# EAGLE design Matrix_True (EAGLE 7.1.0)
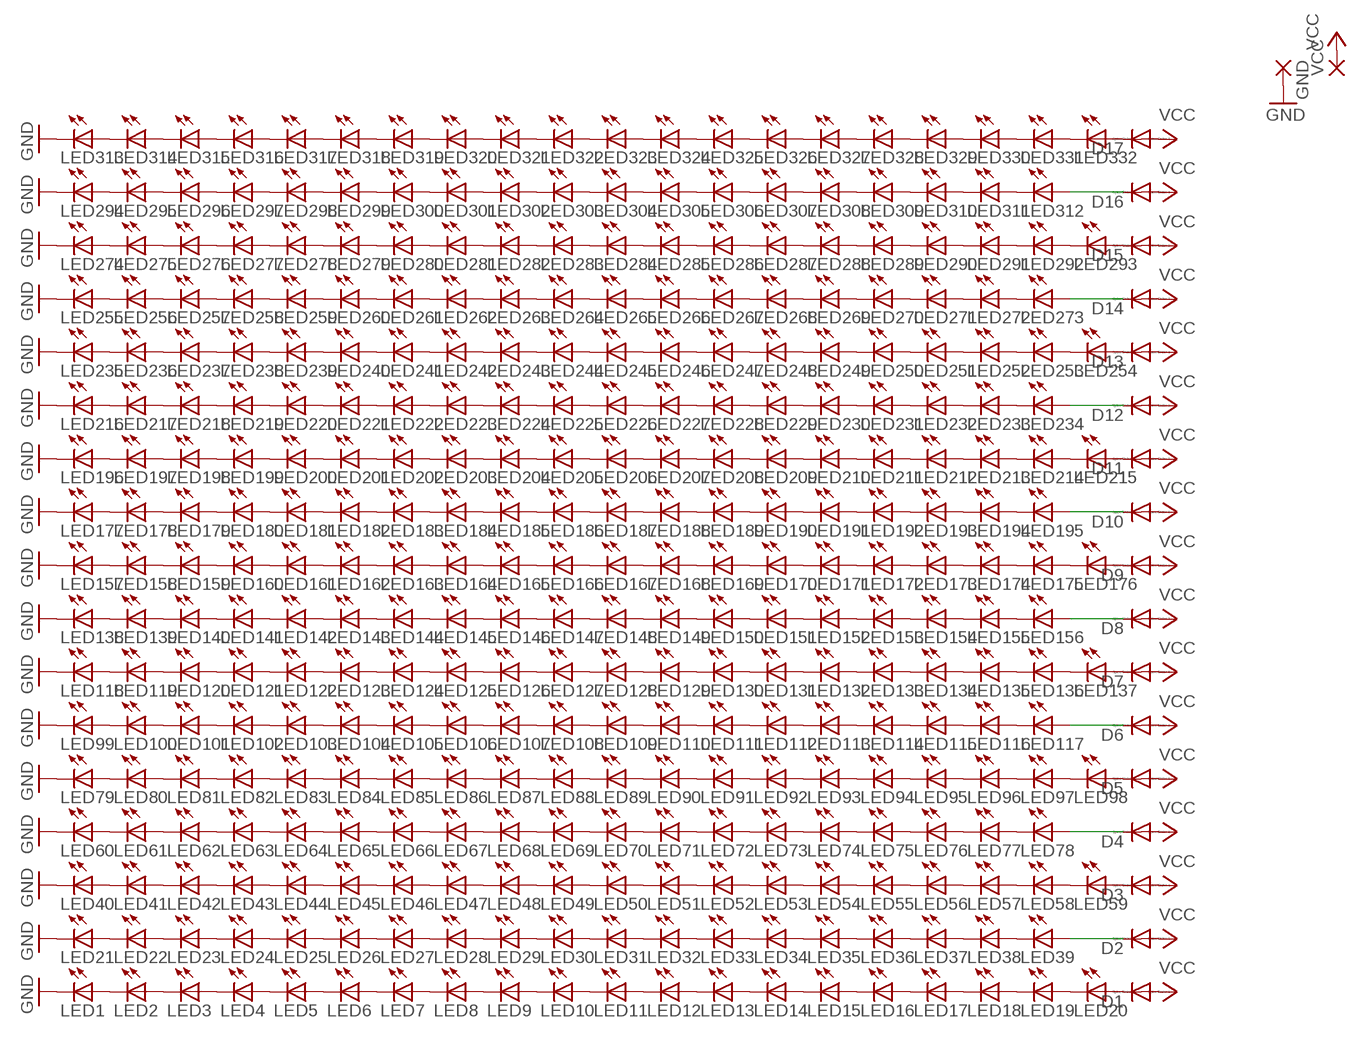
[diagram p0: schematic, sheet 1]

## Parts
D1  DIODE-SOD123  [SOD123]
D2  DIODE-SOD123  [SOD123]
D3  DIODE-SOD123  [SOD123]
D4  DIODE-SOD123  [SOD123]
D5  DIODE-SOD123  [SOD123]
D6  DIODE-SOD123  [SOD123]
D7  DIODE-SOD123  [SOD123]
D8  DIODE-SOD123  [SOD123]
D9  DIODE-SOD123  [SOD123]
D10  DIODE-SOD123  [SOD123]
D11  DIODE-SOD123  [SOD123]
D12  DIODE-SOD123  [SOD123]
D13  DIODE-SOD123  [SOD123]
D14  DIODE-SOD123  [SOD123]
D15  DIODE-SOD123  [SOD123]
D16  DIODE-SOD123  [SOD123]
D17  DIODE-SOD123  [SOD123]
GND  3,17/1,3  [3,17/1,3]
LED1  LED5MM  [LED5MM]
LED2  LED5MM  [LED5MM]
LED3  LED5MM  [LED5MM]
LED4  LED5MM  [LED5MM]
LED5  LED5MM  [LED5MM]
LED6  LED5MM  [LED5MM]
LED7  LED5MM  [LED5MM]
LED8  LED5MM  [LED5MM]
LED9  LED5MM  [LED5MM]
LED10  LED5MM  [LED5MM]
LED11  LED5MM  [LED5MM]
LED12  LED5MM  [LED5MM]
LED13  LED5MM  [LED5MM]
LED14  LED5MM  [LED5MM]
LED15  LED5MM  [LED5MM]
LED16  LED5MM  [LED5MM]
LED17  LED5MM  [LED5MM]
LED18  LED5MM  [LED5MM]
LED19  LED5MM  [LED5MM]
LED20  LED5MM  [LED5MM]
LED21  LED5MM  [LED5MM]
LED22  LED5MM  [LED5MM]
LED23  LED5MM  [LED5MM]
LED24  LED5MM  [LED5MM]
LED25  LED5MM  [LED5MM]
LED26  LED5MM  [LED5MM]
LED27  LED5MM  [LED5MM]
LED28  LED5MM  [LED5MM]
LED29  LED5MM  [LED5MM]
LED30  LED5MM  [LED5MM]
LED31  LED5MM  [LED5MM]
LED32  LED5MM  [LED5MM]
LED33  LED5MM  [LED5MM]
LED34  LED5MM  [LED5MM]
LED35  LED5MM  [LED5MM]
LED36  LED5MM  [LED5MM]
LED37  LED5MM  [LED5MM]
LED38  LED5MM  [LED5MM]
LED39  LED5MM  [LED5MM]
LED40  LED5MM  [LED5MM]
LED41  LED5MM  [LED5MM]
LED42  LED5MM  [LED5MM]
LED43  LED5MM  [LED5MM]
LED44  LED5MM  [LED5MM]
LED45  LED5MM  [LED5MM]
LED46  LED5MM  [LED5MM]
LED47  LED5MM  [LED5MM]
LED48  LED5MM  [LED5MM]
LED49  LED5MM  [LED5MM]
LED50  LED5MM  [LED5MM]
LED51  LED5MM  [LED5MM]
LED52  LED5MM  [LED5MM]
LED53  LED5MM  [LED5MM]
LED54  LED5MM  [LED5MM]
LED55  LED5MM  [LED5MM]
LED56  LED5MM  [LED5MM]
LED57  LED5MM  [LED5MM]
LED58  LED5MM  [LED5MM]
LED59  LED5MM  [LED5MM]
LED60  LED5MM  [LED5MM]
LED61  LED5MM  [LED5MM]
LED62  LED5MM  [LED5MM]
LED63  LED5MM  [LED5MM]
LED64  LED5MM  [LED5MM]
LED65  LED5MM  [LED5MM]
LED66  LED5MM  [LED5MM]
LED67  LED5MM  [LED5MM]
LED68  LED5MM  [LED5MM]
LED69  LED5MM  [LED5MM]
LED70  LED5MM  [LED5MM]
LED71  LED5MM  [LED5MM]
LED72  LED5MM  [LED5MM]
LED73  LED5MM  [LED5MM]
LED74  LED5MM  [LED5MM]
LED75  LED5MM  [LED5MM]
LED76  LED5MM  [LED5MM]
LED77  LED5MM  [LED5MM]
LED78  LED5MM  [LED5MM]
LED79  LED5MM  [LED5MM]
LED80  LED5MM  [LED5MM]
LED81  LED5MM  [LED5MM]
LED82  LED5MM  [LED5MM]
LED83  LED5MM  [LED5MM]
LED84  LED5MM  [LED5MM]
LED85  LED5MM  [LED5MM]
LED86  LED5MM  [LED5MM]
LED87  LED5MM  [LED5MM]
LED88  LED5MM  [LED5MM]
LED89  LED5MM  [LED5MM]
LED90  LED5MM  [LED5MM]
LED91  LED5MM  [LED5MM]
LED92  LED5MM  [LED5MM]
LED93  LED5MM  [LED5MM]
LED94  LED5MM  [LED5MM]
LED95  LED5MM  [LED5MM]
LED96  LED5MM  [LED5MM]
LED97  LED5MM  [LED5MM]
LED98  LED5MM  [LED5MM]
LED99  LED5MM  [LED5MM]
LED100  LED5MM  [LED5MM]
LED101  LED5MM  [LED5MM]
LED102  LED5MM  [LED5MM]
LED103  LED5MM  [LED5MM]
LED104  LED5MM  [LED5MM]
LED105  LED5MM  [LED5MM]
LED106  LED5MM  [LED5MM]
LED107  LED5MM  [LED5MM]
LED108  LED5MM  [LED5MM]
LED109  LED5MM  [LED5MM]
LED110  LED5MM  [LED5MM]
LED111  LED5MM  [LED5MM]
LED112  LED5MM  [LED5MM]
LED113  LED5MM  [LED5MM]
LED114  LED5MM  [LED5MM]
LED115  LED5MM  [LED5MM]
LED116  LED5MM  [LED5MM]
LED117  LED5MM  [LED5MM]
LED118  LED5MM  [LED5MM]
LED119  LED5MM  [LED5MM]
LED120  LED5MM  [LED5MM]
LED121  LED5MM  [LED5MM]
LED122  LED5MM  [LED5MM]
LED123  LED5MM  [LED5MM]
LED124  LED5MM  [LED5MM]
LED125  LED5MM  [LED5MM]
LED126  LED5MM  [LED5MM]
LED127  LED5MM  [LED5MM]
LED128  LED5MM  [LED5MM]
LED129  LED5MM  [LED5MM]
LED130  LED5MM  [LED5MM]
LED131  LED5MM  [LED5MM]
LED132  LED5MM  [LED5MM]
LED133  LED5MM  [LED5MM]
LED134  LED5MM  [LED5MM]
LED135  LED5MM  [LED5MM]
LED136  LED5MM  [LED5MM]
LED137  LED5MM  [LED5MM]
LED138  LED5MM  [LED5MM]
LED139  LED5MM  [LED5MM]
LED140  LED5MM  [LED5MM]
LED141  LED5MM  [LED5MM]
LED142  LED5MM  [LED5MM]
LED143  LED5MM  [LED5MM]
LED144  LED5MM  [LED5MM]
LED145  LED5MM  [LED5MM]
LED146  LED5MM  [LED5MM]
LED147  LED5MM  [LED5MM]
LED148  LED5MM  [LED5MM]
LED149  LED5MM  [LED5MM]
LED150  LED5MM  [LED5MM]
LED151  LED5MM  [LED5MM]
LED152  LED5MM  [LED5MM]
LED153  LED5MM  [LED5MM]
LED154  LED5MM  [LED5MM]
LED155  LED5MM  [LED5MM]
LED156  LED5MM  [LED5MM]
LED157  LED5MM  [LED5MM]
LED158  LED5MM  [LED5MM]
LED159  LED5MM  [LED5MM]
LED160  LED5MM  [LED5MM]
LED161  LED5MM  [LED5MM]
LED162  LED5MM  [LED5MM]
LED163  LED5MM  [LED5MM]
LED164  LED5MM  [LED5MM]
LED165  LED5MM  [LED5MM]
LED166  LED5MM  [LED5MM]
LED167  LED5MM  [LED5MM]
LED168  LED5MM  [LED5MM]
LED169  LED5MM  [LED5MM]
LED170  LED5MM  [LED5MM]
LED171  LED5MM  [LED5MM]
LED172  LED5MM  [LED5MM]
LED173  LED5MM  [LED5MM]
LED174  LED5MM  [LED5MM]
LED175  LED5MM  [LED5MM]
LED176  LED5MM  [LED5MM]
LED177  LED5MM  [LED5MM]
LED178  LED5MM  [LED5MM]
LED179  LED5MM  [LED5MM]
LED180  LED5MM  [LED5MM]
LED181  LED5MM  [LED5MM]
LED182  LED5MM  [LED5MM]
LED183  LED5MM  [LED5MM]
LED184  LED5MM  [LED5MM]
LED185  LED5MM  [LED5MM]
LED186  LED5MM  [LED5MM]
LED187  LED5MM  [LED5MM]
LED188  LED5MM  [LED5MM]
LED189  LED5MM  [LED5MM]
LED190  LED5MM  [LED5MM]
LED191  LED5MM  [LED5MM]
LED192  LED5MM  [LED5MM]
LED193  LED5MM  [LED5MM]
LED194  LED5MM  [LED5MM]
LED195  LED5MM  [LED5MM]
LED196  LED5MM  [LED5MM]
LED197  LED5MM  [LED5MM]
LED198  LED5MM  [LED5MM]
LED199  LED5MM  [LED5MM]
LED200  LED5MM  [LED5MM]
LED201  LED5MM  [LED5MM]
LED202  LED5MM  [LED5MM]
LED203  LED5MM  [LED5MM]
LED204  LED5MM  [LED5MM]
LED205  LED5MM  [LED5MM]
LED206  LED5MM  [LED5MM]
LED207  LED5MM  [LED5MM]
LED208  LED5MM  [LED5MM]
LED209  LED5MM  [LED5MM]
LED210  LED5MM  [LED5MM]
LED211  LED5MM  [LED5MM]
LED212  LED5MM  [LED5MM]
LED213  LED5MM  [LED5MM]
LED214  LED5MM  [LED5MM]
LED215  LED5MM  [LED5MM]
LED216  LED5MM  [LED5MM]
LED217  LED5MM  [LED5MM]
LED218  LED5MM  [LED5MM]
LED219  LED5MM  [LED5MM]
LED220  LED5MM  [LED5MM]
LED221  LED5MM  [LED5MM]
LED222  LED5MM  [LED5MM]
LED223  LED5MM  [LED5MM]
LED224  LED5MM  [LED5MM]
LED225  LED5MM  [LED5MM]
LED226  LED5MM  [LED5MM]
LED227  LED5MM  [LED5MM]
LED228  LED5MM  [LED5MM]
LED229  LED5MM  [LED5MM]
LED230  LED5MM  [LED5MM]
LED231  LED5MM  [LED5MM]
LED232  LED5MM  [LED5MM]
LED233  LED5MM  [LED5MM]
LED234  LED5MM  [LED5MM]
LED235  LED5MM  [LED5MM]
LED236  LED5MM  [LED5MM]
LED237  LED5MM  [LED5MM]
LED238  LED5MM  [LED5MM]
LED239  LED5MM  [LED5MM]
LED240  LED5MM  [LED5MM]
LED241  LED5MM  [LED5MM]
LED242  LED5MM  [LED5MM]
LED243  LED5MM  [LED5MM]
LED244  LED5MM  [LED5MM]
LED245  LED5MM  [LED5MM]
LED246  LED5MM  [LED5MM]
LED247  LED5MM  [LED5MM]
LED248  LED5MM  [LED5MM]
LED249  LED5MM  [LED5MM]
LED250  LED5MM  [LED5MM]
LED251  LED5MM  [LED5MM]
LED252  LED5MM  [LED5MM]
LED253  LED5MM  [LED5MM]
LED254  LED5MM  [LED5MM]
LED255  LED5MM  [LED5MM]
LED256  LED5MM  [LED5MM]
LED257  LED5MM  [LED5MM]
LED258  LED5MM  [LED5MM]
LED259  LED5MM  [LED5MM]
LED260  LED5MM  [LED5MM]
LED261  LED5MM  [LED5MM]
LED262  LED5MM  [LED5MM]
LED263  LED5MM  [LED5MM]
LED264  LED5MM  [LED5MM]
LED265  LED5MM  [LED5MM]
LED266  LED5MM  [LED5MM]
LED267  LED5MM  [LED5MM]
LED268  LED5MM  [LED5MM]
LED269  LED5MM  [LED5MM]
LED270  LED5MM  [LED5MM]
LED271  LED5MM  [LED5MM]
LED272  LED5MM  [LED5MM]
LED273  LED5MM  [LED5MM]
LED274  LED5MM  [LED5MM]
LED275  LED5MM  [LED5MM]
LED276  LED5MM  [LED5MM]
LED277  LED5MM  [LED5MM]
LED278  LED5MM  [LED5MM]
LED279  LED5MM  [LED5MM]
LED280  LED5MM  [LED5MM]
LED281  LED5MM  [LED5MM]
LED282  LED5MM  [LED5MM]
LED283  LED5MM  [LED5MM]
LED284  LED5MM  [LED5MM]
LED285  LED5MM  [LED5MM]
LED286  LED5MM  [LED5MM]
LED287  LED5MM  [LED5MM]
LED288  LED5MM  [LED5MM]
LED289  LED5MM  [LED5MM]
LED290  LED5MM  [LED5MM]
LED291  LED5MM  [LED5MM]
LED292  LED5MM  [LED5MM]
LED293  LED5MM  [LED5MM]
LED294  LED5MM  [LED5MM]
LED295  LED5MM  [LED5MM]
LED296  LED5MM  [LED5MM]
LED297  LED5MM  [LED5MM]
LED298  LED5MM  [LED5MM]
LED299  LED5MM  [LED5MM]
LED300  LED5MM  [LED5MM]
LED301  LED5MM  [LED5MM]
LED302  LED5MM  [LED5MM]
LED303  LED5MM  [LED5MM]
LED304  LED5MM  [LED5MM]
LED305  LED5MM  [LED5MM]
LED306  LED5MM  [LED5MM]
LED307  LED5MM  [LED5MM]
LED308  LED5MM  [LED5MM]
LED309  LED5MM  [LED5MM]
LED310  LED5MM  [LED5MM]
LED311  LED5MM  [LED5MM]
LED312  LED5MM  [LED5MM]
LED313  LED5MM  [LED5MM]
LED314  LED5MM  [LED5MM]
LED315  LED5MM  [LED5MM]
LED316  LED5MM  [LED5MM]
LED317  LED5MM  [LED5MM]
LED318  LED5MM  [LED5MM]
LED319  LED5MM  [LED5MM]
LED320  LED5MM  [LED5MM]
LED321  LED5MM  [LED5MM]
LED322  LED5MM  [LED5MM]
LED323  LED5MM  [LED5MM]
LED324  LED5MM  [LED5MM]
LED325  LED5MM  [LED5MM]
LED326  LED5MM  [LED5MM]
LED327  LED5MM  [LED5MM]
LED328  LED5MM  [LED5MM]
LED329  LED5MM  [LED5MM]
LED330  LED5MM  [LED5MM]
LED331  LED5MM  [LED5MM]
LED332  LED5MM  [LED5MM]
VCC  3,17/1,3  [3,17/1,3]

## Nets
GND: GND.1(P) LED1.K(C) LED21.K(C) LED40.K(C) LED60.K(C) LED79.K(C) LED99.K(C) LED118.K(C) LED138.K(C) LED157.K(C) LED177.K(C) LED196.K(C) LED216.K(C) LED235.K(C) LED255.K(C) LED274.K(C) LED294.K(C) LED313.K(C)
N$1: LED1.A LED2.K(C)
N$2: LED2.A LED3.K(C)
N$3: LED3.A LED4.K(C)
N$4: LED4.A LED5.K(C)
N$5: LED5.A LED6.K(C)
N$6: LED6.A LED7.K(C)
N$7: LED7.A LED8.K(C)
N$8: LED8.A LED9.K(C)
N$9: LED9.A LED10.K(C)
N$10: LED10.A LED11.K(C)
N$11: LED11.A LED12.K(C)
N$12: LED12.A LED13.K(C)
N$13: LED13.A LED14.K(C)
N$14: LED14.A LED15.K(C)
N$15: LED15.A LED16.K(C)
N$16: LED16.A LED17.K(C)
N$17: LED17.A LED18.K(C)
N$18: LED18.A LED19.K(C)
N$19: LED19.A LED20.K(C)
N$20: D1.C LED20.A
N$21: LED21.A LED22.K(C)
N$22: LED22.A LED23.K(C)
N$23: LED23.A LED24.K(C)
N$24: LED24.A LED25.K(C)
N$25: LED25.A LED26.K(C)
N$26: LED26.A LED27.K(C)
N$27: LED27.A LED28.K(C)
N$28: LED28.A LED29.K(C)
N$29: LED29.A LED30.K(C)
N$30: LED30.A LED31.K(C)
N$31: LED31.A LED32.K(C)
N$32: LED32.A LED33.K(C)
N$33: LED33.A LED34.K(C)
N$34: LED34.A LED35.K(C)
N$35: LED35.A LED36.K(C)
N$36: LED36.A LED37.K(C)
N$37: LED37.A LED38.K(C)
N$38: LED38.A LED39.K(C)
N$39: D2.C LED39.A
N$40: LED40.A LED41.K(C)
N$41: LED41.A LED42.K(C)
N$42: LED42.A LED43.K(C)
N$43: LED43.A LED44.K(C)
N$44: LED44.A LED45.K(C)
N$45: LED45.A LED46.K(C)
N$46: LED46.A LED47.K(C)
N$47: LED47.A LED48.K(C)
N$48: LED48.A LED49.K(C)
N$49: LED49.A LED50.K(C)
N$50: LED50.A LED51.K(C)
N$51: LED51.A LED52.K(C)
N$52: LED52.A LED53.K(C)
N$53: LED53.A LED54.K(C)
N$54: LED54.A LED55.K(C)
N$55: LED55.A LED56.K(C)
N$56: LED56.A LED57.K(C)
N$57: LED57.A LED58.K(C)
N$58: LED58.A LED59.K(C)
N$59: D3.C LED59.A
N$60: LED60.A LED61.K(C)
N$61: LED61.A LED62.K(C)
N$62: LED62.A LED63.K(C)
N$63: LED63.A LED64.K(C)
N$64: LED64.A LED65.K(C)
N$65: LED65.A LED66.K(C)
N$66: LED66.A LED67.K(C)
N$67: LED67.A LED68.K(C)
N$68: LED68.A LED69.K(C)
N$69: LED69.A LED70.K(C)
N$70: LED70.A LED71.K(C)
N$71: LED71.A LED72.K(C)
N$72: LED72.A LED73.K(C)
N$73: LED73.A LED74.K(C)
N$74: LED74.A LED75.K(C)
N$75: LED75.A LED76.K(C)
N$76: LED76.A LED77.K(C)
N$77: LED77.A LED78.K(C)
N$78: D4.C LED78.A
N$79: LED79.A LED80.K(C)
N$80: LED80.A LED81.K(C)
N$81: LED81.A LED82.K(C)
N$82: LED82.A LED83.K(C)
N$83: LED83.A LED84.K(C)
N$84: LED84.A LED85.K(C)
N$85: LED85.A LED86.K(C)
N$86: LED86.A LED87.K(C)
N$87: LED87.A LED88.K(C)
N$88: LED88.A LED89.K(C)
N$89: LED89.A LED90.K(C)
N$90: LED90.A LED91.K(C)
N$91: LED91.A LED92.K(C)
N$92: LED92.A LED93.K(C)
N$93: LED93.A LED94.K(C)
N$94: LED94.A LED95.K(C)
N$95: LED95.A LED96.K(C)
N$96: LED96.A LED97.K(C)
N$97: LED97.A LED98.K(C)
N$98: D5.C LED98.A
N$99: LED99.A LED100.K(C)
N$100: LED100.A LED101.K(C)
N$101: LED101.A LED102.K(C)
N$102: LED102.A LED103.K(C)
N$103: LED103.A LED104.K(C)
N$104: LED104.A LED105.K(C)
N$105: LED105.A LED106.K(C)
N$106: LED106.A LED107.K(C)
N$107: LED107.A LED108.K(C)
N$108: LED108.A LED109.K(C)
N$109: LED109.A LED110.K(C)
N$110: LED110.A LED111.K(C)
N$111: LED111.A LED112.K(C)
N$112: LED112.A LED113.K(C)
N$113: LED113.A LED114.K(C)
N$114: LED114.A LED115.K(C)
N$115: LED115.A LED116.K(C)
N$116: LED116.A LED117.K(C)
N$117: D6.C LED117.A
N$118: LED118.A LED119.K(C)
N$119: LED119.A LED120.K(C)
N$120: LED120.A LED121.K(C)
N$121: LED121.A LED122.K(C)
N$122: LED122.A LED123.K(C)
N$123: LED123.A LED124.K(C)
N$124: LED124.A LED125.K(C)
N$125: LED125.A LED126.K(C)
N$126: LED126.A LED127.K(C)
N$127: LED127.A LED128.K(C)
N$128: LED128.A LED129.K(C)
N$129: LED129.A LED130.K(C)
N$130: LED130.A LED131.K(C)
N$131: LED131.A LED132.K(C)
N$132: LED132.A LED133.K(C)
N$133: LED133.A LED134.K(C)
N$134: LED134.A LED135.K(C)
N$135: LED135.A LED136.K(C)
N$136: LED136.A LED137.K(C)
N$137: D7.C LED137.A
N$138: LED138.A LED139.K(C)
N$139: LED139.A LED140.K(C)
N$140: LED140.A LED141.K(C)
N$141: LED141.A LED142.K(C)
N$142: LED142.A LED143.K(C)
N$143: LED143.A LED144.K(C)
N$144: LED144.A LED145.K(C)
N$145: LED145.A LED146.K(C)
N$146: LED146.A LED147.K(C)
N$147: LED147.A LED148.K(C)
N$148: LED148.A LED149.K(C)
N$149: LED149.A LED150.K(C)
N$150: LED150.A LED151.K(C)
N$151: LED151.A LED152.K(C)
N$152: LED152.A LED153.K(C)
N$153: LED153.A LED154.K(C)
N$154: LED154.A LED155.K(C)
N$155: LED155.A LED156.K(C)
N$156: D8.C LED156.A
N$157: LED157.A LED158.K(C)
N$158: LED158.A LED159.K(C)
N$159: LED159.A LED160.K(C)
N$160: LED160.A LED161.K(C)
N$161: LED161.A LED162.K(C)
N$162: LED162.A LED163.K(C)
N$163: LED163.A LED164.K(C)
N$164: LED164.A LED165.K(C)
N$165: LED165.A LED166.K(C)
N$166: LED166.A LED167.K(C)
N$167: LED167.A LED168.K(C)
N$168: LED168.A LED169.K(C)
N$169: LED169.A LED170.K(C)
N$170: LED170.A LED171.K(C)
N$171: LED171.A LED172.K(C)
N$172: LED172.A LED173.K(C)
N$173: LED173.A LED174.K(C)
N$174: LED174.A LED175.K(C)
N$175: LED175.A LED176.K(C)
N$176: D9.C LED176.A
N$177: LED177.A LED178.K(C)
N$178: LED178.A LED179.K(C)
N$179: LED179.A LED180.K(C)
N$180: LED180.A LED181.K(C)
N$181: LED181.A LED182.K(C)
N$182: LED182.A LED183.K(C)
N$183: LED183.A LED184.K(C)
N$184: LED184.A LED185.K(C)
N$185: LED185.A LED186.K(C)
N$186: LED186.A LED187.K(C)
N$187: LED187.A LED188.K(C)
N$188: LED188.A LED189.K(C)
N$189: LED189.A LED190.K(C)
N$190: LED190.A LED191.K(C)
N$191: LED191.A LED192.K(C)
N$192: LED192.A LED193.K(C)
N$193: LED193.A LED194.K(C)
N$194: LED194.A LED195.K(C)
N$195: D10.C LED195.A
N$196: LED196.A LED197.K(C)
N$197: LED197.A LED198.K(C)
N$198: LED198.A LED199.K(C)
N$199: LED199.A LED200.K(C)
N$200: LED200.A LED201.K(C)
N$201: LED201.A LED202.K(C)
N$202: LED202.A LED203.K(C)
N$203: LED203.A LED204.K(C)
N$204: LED204.A LED205.K(C)
N$205: LED205.A LED206.K(C)
N$206: LED206.A LED207.K(C)
N$207: LED207.A LED208.K(C)
N$208: LED208.A LED209.K(C)
N$209: LED209.A LED210.K(C)
N$210: LED210.A LED211.K(C)
N$211: LED211.A LED212.K(C)
N$212: LED212.A LED213.K(C)
N$213: LED213.A LED214.K(C)
N$214: LED214.A LED215.K(C)
N$215: D11.C LED215.A
N$216: LED216.A LED217.K(C)
N$217: LED217.A LED218.K(C)
N$218: LED218.A LED219.K(C)
N$219: LED219.A LED220.K(C)
N$220: LED220.A LED221.K(C)
N$221: LED221.A LED222.K(C)
N$222: LED222.A LED223.K(C)
N$223: LED223.A LED224.K(C)
N$224: LED224.A LED225.K(C)
N$225: LED225.A LED226.K(C)
N$226: LED226.A LED227.K(C)
N$227: LED227.A LED228.K(C)
N$228: LED228.A LED229.K(C)
N$229: LED229.A LED230.K(C)
N$230: LED230.A LED231.K(C)
N$231: LED231.A LED232.K(C)
N$232: LED232.A LED233.K(C)
N$233: LED233.A LED234.K(C)
N$234: D12.C LED234.A
N$235: LED235.A LED236.K(C)
N$236: LED236.A LED237.K(C)
N$237: LED237.A LED238.K(C)
N$238: LED238.A LED239.K(C)
N$239: LED239.A LED240.K(C)
N$240: LED240.A LED241.K(C)
N$241: LED241.A LED242.K(C)
N$242: LED242.A LED243.K(C)
N$243: LED243.A LED244.K(C)
N$244: LED244.A LED245.K(C)
N$245: LED245.A LED246.K(C)
N$246: LED246.A LED247.K(C)
N$247: LED247.A LED248.K(C)
N$248: LED248.A LED249.K(C)
N$249: LED249.A LED250.K(C)
N$250: LED250.A LED251.K(C)
N$251: LED251.A LED252.K(C)
N$252: LED252.A LED253.K(C)
N$253: LED253.A LED254.K(C)
N$254: D13.C LED254.A
N$255: LED255.A LED256.K(C)
N$256: LED256.A LED257.K(C)
N$257: LED257.A LED258.K(C)
N$258: LED258.A LED259.K(C)
N$259: LED259.A LED260.K(C)
N$260: LED260.A LED261.K(C)
N$261: LED261.A LED262.K(C)
N$262: LED262.A LED263.K(C)
N$263: LED263.A LED264.K(C)
N$264: LED264.A LED265.K(C)
N$265: LED265.A LED266.K(C)
N$266: LED266.A LED267.K(C)
N$267: LED267.A LED268.K(C)
N$268: LED268.A LED269.K(C)
N$269: LED269.A LED270.K(C)
N$270: LED270.A LED271.K(C)
N$271: LED271.A LED272.K(C)
N$272: LED272.A LED273.K(C)
N$273: D14.C LED273.A
N$274: LED274.A LED275.K(C)
N$275: LED275.A LED276.K(C)
N$276: LED276.A LED277.K(C)
N$277: LED277.A LED278.K(C)
N$278: LED278.A LED279.K(C)
N$279: LED279.A LED280.K(C)
N$280: LED280.A LED281.K(C)
N$281: LED281.A LED282.K(C)
N$282: LED282.A LED283.K(C)
N$283: LED283.A LED284.K(C)
N$284: LED284.A LED285.K(C)
N$285: LED285.A LED286.K(C)
N$286: LED286.A LED287.K(C)
N$287: LED287.A LED288.K(C)
N$288: LED288.A LED289.K(C)
N$289: LED289.A LED290.K(C)
N$290: LED290.A LED291.K(C)
N$291: LED291.A LED292.K(C)
N$292: LED292.A LED293.K(C)
N$293: D15.C LED293.A
N$294: LED294.A LED295.K(C)
N$295: LED295.A LED296.K(C)
N$296: LED296.A LED297.K(C)
N$297: LED297.A LED298.K(C)
N$298: LED298.A LED299.K(C)
N$299: LED299.A LED300.K(C)
N$300: LED300.A LED301.K(C)
N$301: LED301.A LED302.K(C)
N$302: LED302.A LED303.K(C)
N$303: LED303.A LED304.K(C)
N$304: LED304.A LED305.K(C)
N$305: LED305.A LED306.K(C)
N$306: LED306.A LED307.K(C)
N$307: LED307.A LED308.K(C)
N$308: LED308.A LED309.K(C)
N$309: LED309.A LED310.K(C)
N$310: LED310.A LED311.K(C)
N$311: LED311.A LED312.K(C)
N$312: D16.C LED312.A
N$313: LED313.A LED314.K(C)
N$314: LED314.A LED315.K(C)
N$315: LED315.A LED316.K(C)
N$316: LED316.A LED317.K(C)
N$317: LED317.A LED318.K(C)
N$318: LED318.A LED319.K(C)
N$319: LED319.A LED320.K(C)
N$320: LED320.A LED321.K(C)
N$321: LED321.A LED322.K(C)
N$322: LED322.A LED323.K(C)
N$323: LED323.A LED324.K(C)
N$324: LED324.A LED325.K(C)
N$325: LED325.A LED326.K(C)
N$326: LED326.A LED327.K(C)
N$327: LED327.A LED328.K(C)
N$328: LED328.A LED329.K(C)
N$329: LED329.A LED330.K(C)
N$330: LED330.A LED331.K(C)
N$331: LED331.A LED332.K(C)
N$332: D17.C LED332.A
VCC: D1.A D2.A D3.A D4.A D5.A D6.A D7.A D8.A D9.A D10.A D11.A D12.A D13.A D14.A D15.A D16.A D17.A VCC.1(P)

## Library data of the parts
D1-D17 = diode:DIODE-: DIODE
GND VCC = wirepad:3,17/1,3: THROUGH-HOLE PAD
LED1-LED332 = led:LED: LED OSRAM: - CHIPLED LG R971, LG N971, LY N971, LG Q971, LY Q971, LO R971, LY R971 LH N974, LH R974 LS Q976, LO Q976, LY Q976 LO Q996 - Hyper CHIPLED LW Q18S LB Q993, LB Q99A, LB R99A - SideLED LS A670, LO A670, LY A670, LG A670, LP A670 LB A673, LV A673, LT A673, LW A673 LH A674 LY A675 LS A676, LA A676, LO A676, LY A676, LW A676 LS A679, LY A679, LG A679 - Hyper Micro SIDELED® LS Y876, LA Y876, LO Y876, LY Y876 LT Y87S - SmartLED LW L88C, LW L88S LB L89C, LB L89S, LG L890 LS L89K, LO L89K, LY L89K LS L896, LA L896, LO L896, LY L896 - TOPLED LS T670, LO T670, LY T670, LG T670, LP T670 LSG T670, LSP T670, LSY T670, LOP T670, LYG T670 LG T671, LOG T671, LSG T671 LB T673, LV T673, LT T673, LW T673 LH T674 LS T676, LA T676, LO T676, LY T676, LB T676, LH T676, LSB T676, LW T676 LB T67C, LV T67C, LT T67C, LS T67K, LO T67K, LY T67K, LW E67C LS E67B, LA E67B, LO E67B, LY E67B, LB E67C, LV E67C, LT E67C LW T67C LS T679, LY T679, LG T679 LS T770, LO T770, LY T770, LG T770, LP T770 LB T773, LV T773, LT T773, LW T773 LH T774 LS E675, LA E675, LY E675, LS T675 LS T776, LA T776, LO T776, LY T776, LB T776 LHGB T686 LT T68C, LB T68C - Hyper Mini TOPLED® LB M676 - Mini TOPLED Santana® LG M470 LS M47K, LO M47K, LY M47K Source: http://www.osram.convergy.de LUXEON: - LUMILED® LXK2-PW12-R00, LXK2-PW12-S00, LXK2-PW14-U00, LXK2-PW14-V00 LXK2-PM12-R00, LXK2-PM12-S00, LXK2-PM14-U00 LXK2-PE12-Q00, LXK2-PE12-R00, LXK2-PE12-S00, LXK2-PE14-T00, LXK2-PE14-U00 LXK2-PB12-K00, LXK2-PB12-L00, LXK2-PB12-M00, LXK2-PB14-N00, LXK2-PB14-P00, LXK2-PB14-Q00 LXK2-PR12-L00, LXK2-PR12-M00, LXK2-PR14-Q00, LXK2-PR14-R00 LXK2-PD12-Q00, LXK2-PD12-R00, LXK2-PD12-S00 LXK2-PH12-R00, LXK2-PH12-S00 LXK2-PL12-P00, LXK2-PL12-Q00, LXK2-PL12-R00 Source: www.luxeon.com KINGBRIGHT: KA-3528ASYC Source: www.kingbright.com

## Board
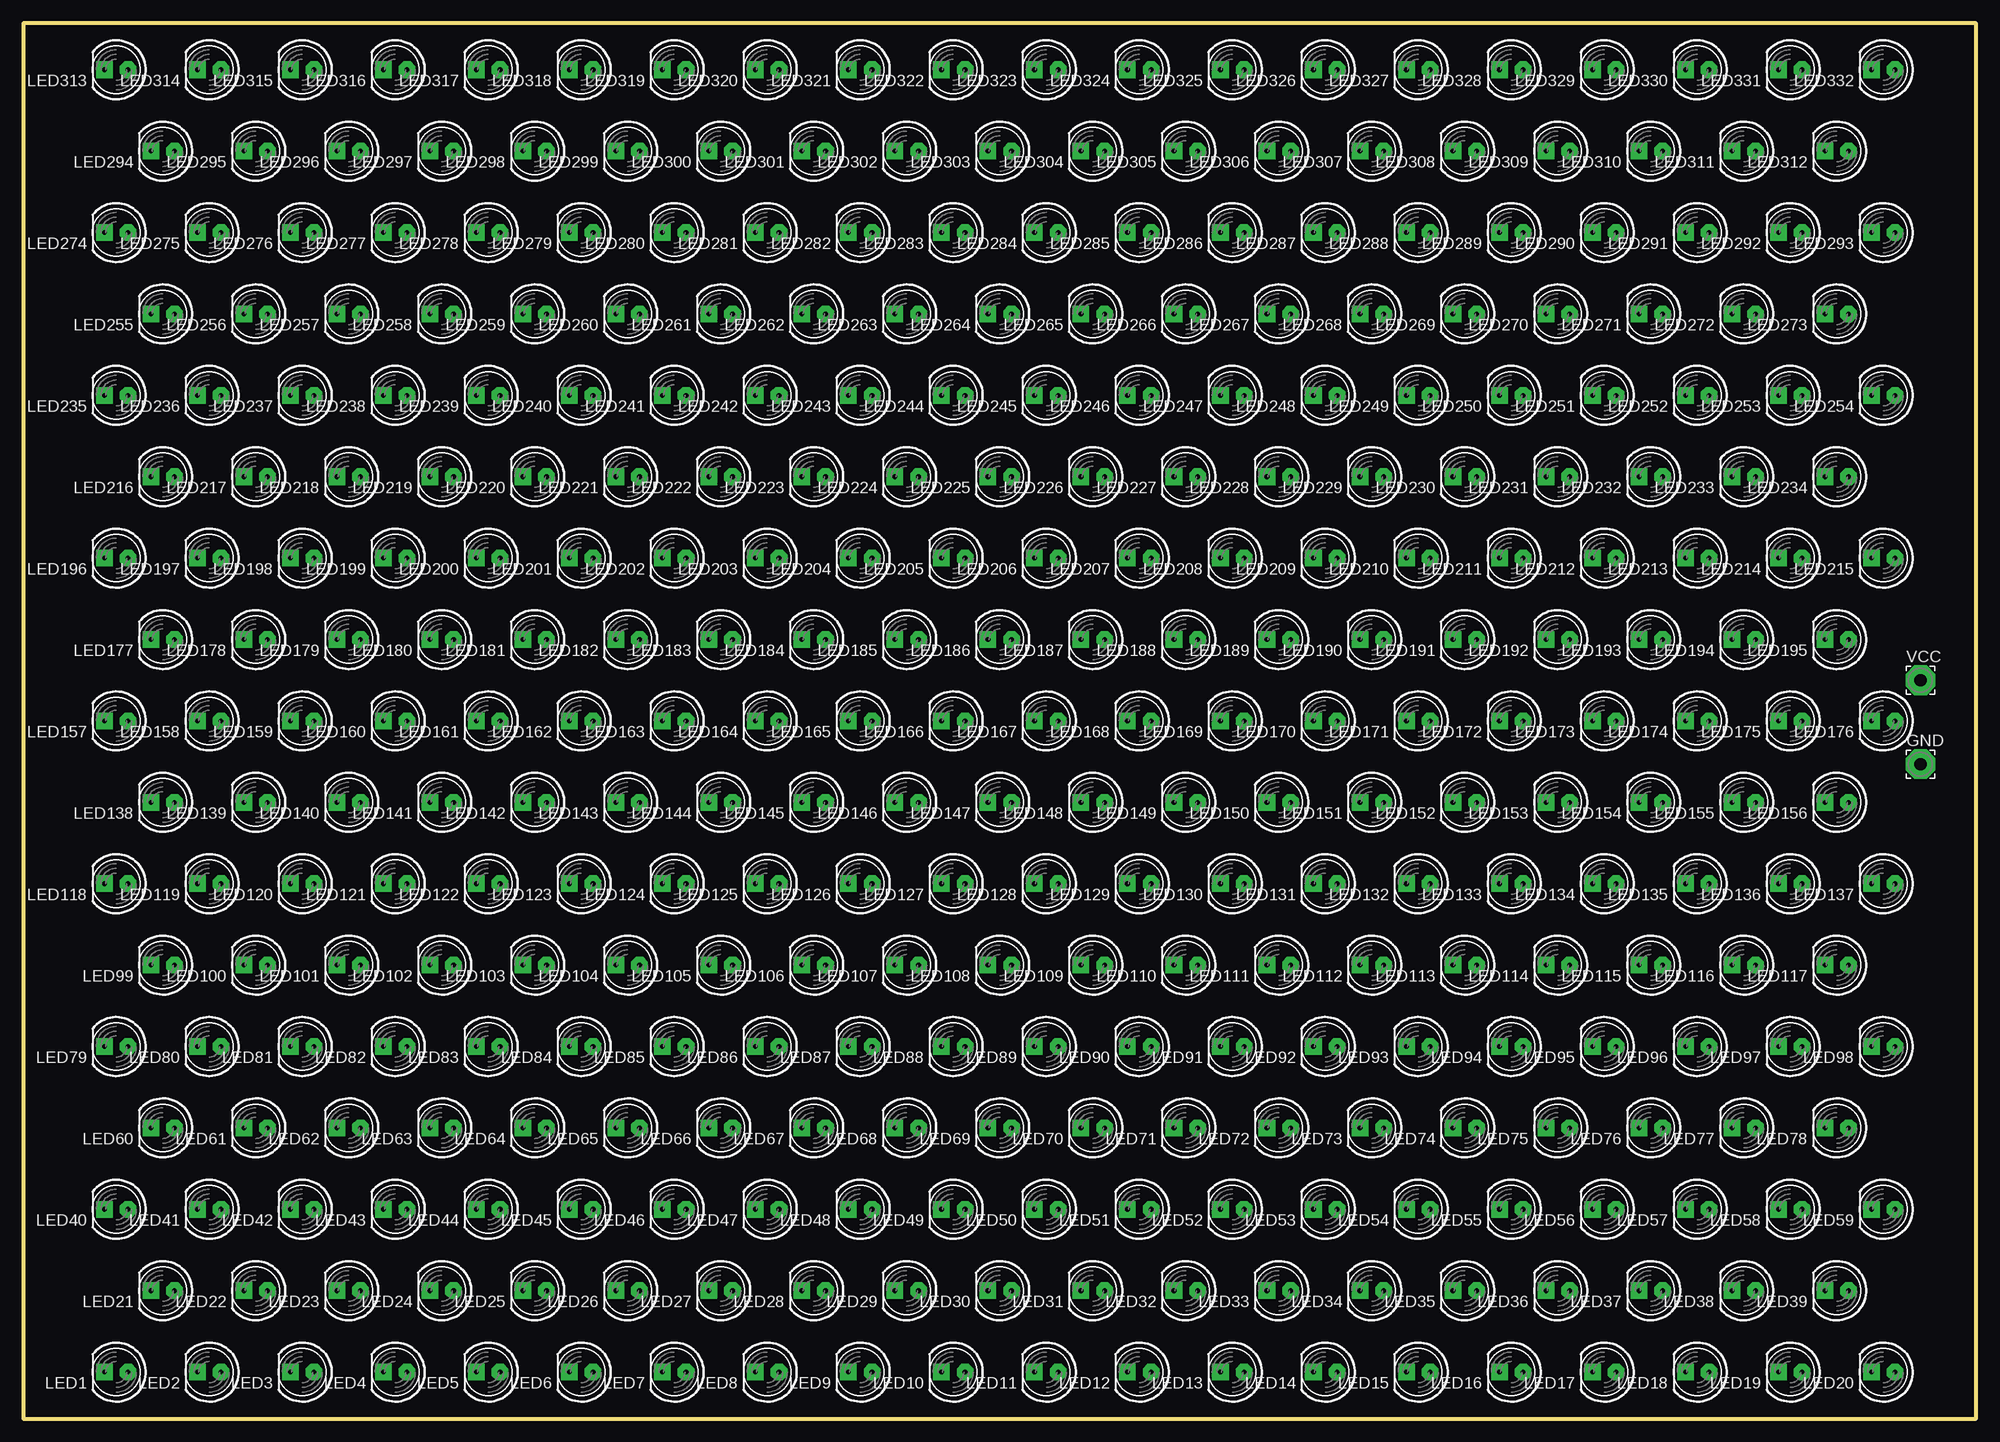
[diagram p1: board, top side]
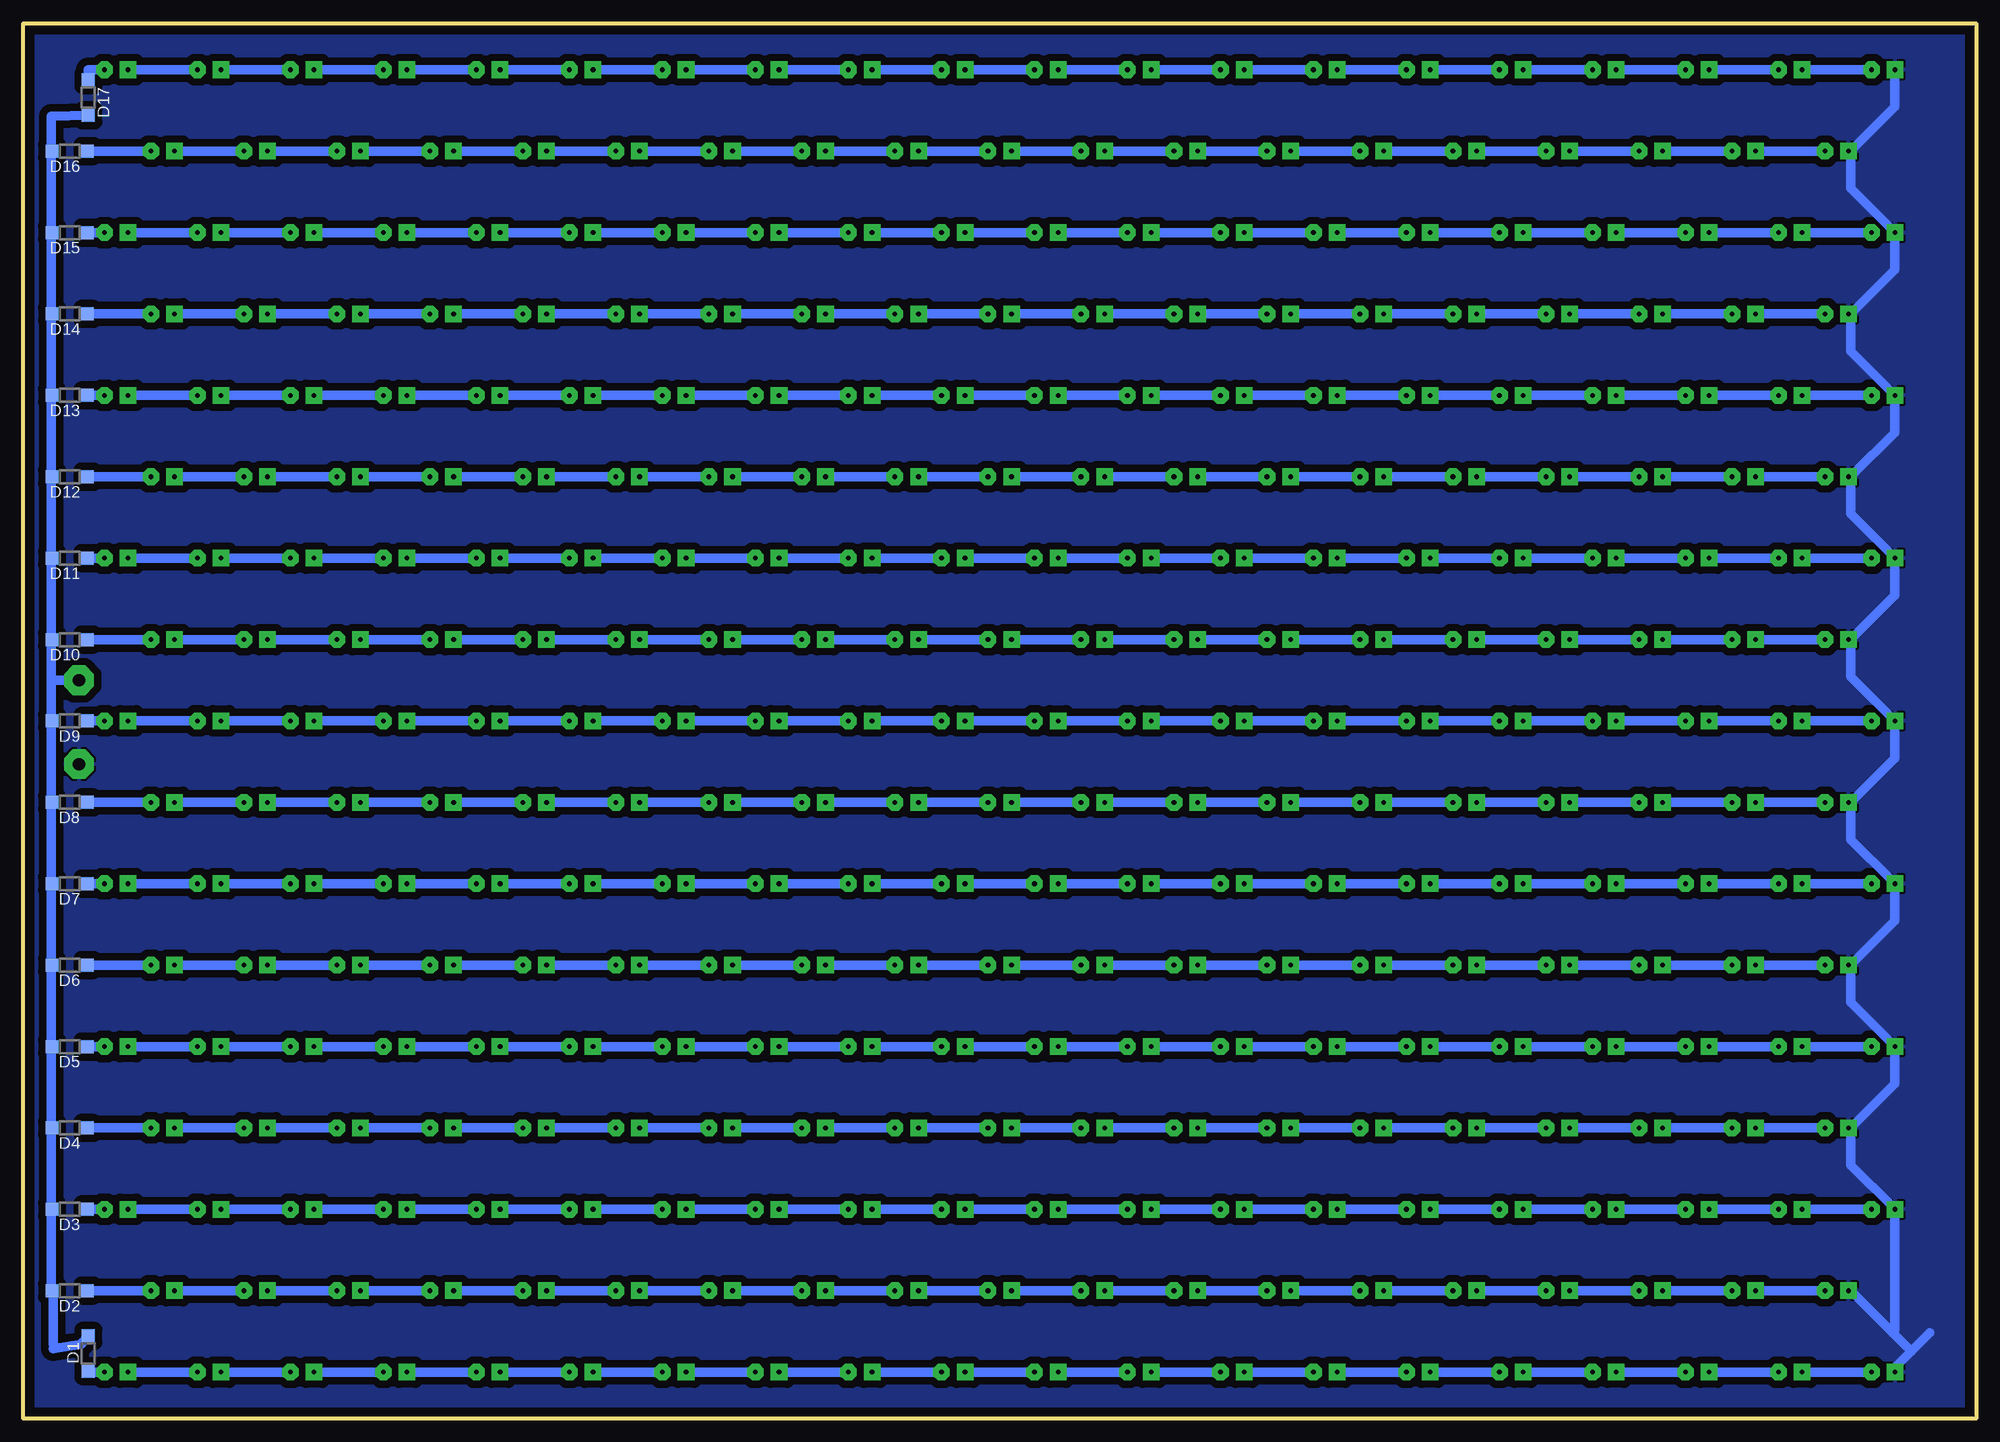
[diagram p2: board, bottom side, seen from below]

Size 210 x 150 mm. Coordinates in mm from the lower left corner, seen from the top.
Outline: 0,0 210,0 210,150 0,150 0,0
Copper layers (1*16): Top 0.035mm / dielectric 1.5mm / Bottom 0.035mm
Design rules "default *": minimum track width 1mm, minimum drill 24mil, track to track 8mil, track to pad 8mil, pad to pad 8mil, via to via 8mil, smd to smd 8mil, copper to edge 40mil, drill to drill 8mil, minimum pad ring 10mil, minimum via ring 8mil, stop-mask expansion 4mil, vias tented up to drill 0mil, thermal gap 10mil

### Footprints (pad centres in the part's own frame; a part is rotated, then mirrored left to right if it is on the bottom)
SOD123 = smd 1.4 x 1.4: A 1.9,0; C -1.9,0
3,17/1,3 = drill 1.321 pad 3.175 octagon: 1 0,0
LED5MM = drill 0.5 pad 1.778 octagon: A -1.27,0 | drill 0.5 pad 1.778 square: K 1.27,0

### Placement (x,y rotation side)
D1  203,7 90 bottom
D2  205,13.75 180 bottom
D3  205,22.5 180 bottom
D4  205,31.25 180 bottom
D5  205,40 180 bottom
D6  205,48.75 180 bottom
D7  205,57.5 180 bottom
D8  205,66.25 180 bottom
D9  205,75 180 bottom
D10  205,83.75 180 bottom
D11  205,92.5 180 bottom
D12  205,101.25 180 bottom
D13  205,110 180 bottom
D14  205,118.75 180 bottom
D15  205,127.5 180 bottom
D16  205,136.25 180 bottom
D17  203,142 270 bottom
GND  204,70.35 0 top
LED1  10,5 180 top
LED2  20,5 180 top
LED3  30,5 180 top
LED4  40,5 180 top
LED5  50,5 180 top
LED6  60,5 180 top
LED7  70,5 180 top
LED8  80,5 180 top
LED9  90,5 180 top
LED10  100,5 180 top
LED11  110,5 180 top
LED12  120,5 180 top
LED13  130,5 180 top
LED14  140,5 180 top
LED15  150,5 180 top
LED16  160,5 180 top
LED17  170,5 180 top
LED18  180,5 180 top
LED19  190,5 180 top
LED20  200,5 180 top
LED21  15,13.75 180 top
LED22  25,13.75 180 top
LED23  35,13.75 180 top
LED24  45,13.75 180 top
LED25  55,13.75 180 top
LED26  65,13.75 180 top
LED27  75,13.75 180 top
LED28  85,13.75 180 top
LED29  95,13.75 180 top
LED30  105,13.75 180 top
LED31  115,13.75 180 top
LED32  125,13.75 180 top
LED33  135,13.75 180 top
LED34  145,13.75 180 top
LED35  155,13.75 180 top
LED36  165,13.75 180 top
LED37  175,13.75 180 top
LED38  185,13.75 180 top
LED39  195,13.75 180 top
LED40  10,22.5 180 top
LED41  20,22.5 180 top
LED42  30,22.5 180 top
LED43  40,22.5 180 top
LED44  50,22.5 180 top
LED45  60,22.5 180 top
LED46  70,22.5 180 top
LED47  80,22.5 180 top
LED48  90,22.5 180 top
LED49  100,22.5 180 top
LED50  110,22.5 180 top
LED51  120,22.5 180 top
LED52  130,22.5 180 top
LED53  140,22.5 180 top
LED54  150,22.5 180 top
LED55  160,22.5 180 top
LED56  170,22.5 180 top
LED57  180,22.5 180 top
LED58  190,22.5 180 top
LED59  200,22.5 180 top
LED60  15,31.25 180 top
LED61  25,31.25 180 top
LED62  35,31.25 180 top
LED63  45,31.25 180 top
LED64  55,31.25 180 top
LED65  65,31.25 180 top
LED66  75,31.25 180 top
LED67  85,31.25 180 top
LED68  95,31.25 180 top
LED69  105,31.25 180 top
LED70  115,31.25 180 top
LED71  125,31.25 180 top
LED72  135,31.25 180 top
LED73  145,31.25 180 top
LED74  155,31.25 180 top
LED75  165,31.25 180 top
LED76  175,31.25 180 top
LED77  185,31.25 180 top
LED78  195,31.25 180 top
LED79  10,40 180 top
LED80  20,40 180 top
LED81  30,40 180 top
LED82  40,40 180 top
LED83  50,40 180 top
LED84  60,40 180 top
LED85  70,40 180 top
LED86  80,40 180 top
LED87  90,40 180 top
LED88  100,40 180 top
LED89  110,40 180 top
LED90  120,40 180 top
LED91  130,40 180 top
LED92  140,40 180 top
LED93  150,40 180 top
LED94  160,40 180 top
LED95  170,40 180 top
LED96  180,40 180 top
LED97  190,40 180 top
LED98  200,40 180 top
LED99  15,48.75 180 top
LED100  25,48.75 180 top
LED101  35,48.75 180 top
LED102  45,48.75 180 top
LED103  55,48.75 180 top
LED104  65,48.75 180 top
LED105  75,48.75 180 top
LED106  85,48.75 180 top
LED107  95,48.75 180 top
LED108  105,48.75 180 top
LED109  115,48.75 180 top
LED110  125,48.75 180 top
LED111  135,48.75 180 top
LED112  145,48.75 180 top
LED113  155,48.75 180 top
LED114  165,48.75 180 top
LED115  175,48.75 180 top
LED116  185,48.75 180 top
LED117  195,48.75 180 top
LED118  10,57.5 180 top
LED119  20,57.5 180 top
LED120  30,57.5 180 top
LED121  40,57.5 180 top
LED122  50,57.5 180 top
LED123  60,57.5 180 top
LED124  70,57.5 180 top
LED125  80,57.5 180 top
LED126  90,57.5 180 top
LED127  100,57.5 180 top
LED128  110,57.5 180 top
LED129  120,57.5 180 top
LED130  130,57.5 180 top
LED131  140,57.5 180 top
LED132  150,57.5 180 top
LED133  160,57.5 180 top
LED134  170,57.5 180 top
LED135  180,57.5 180 top
LED136  190,57.5 180 top
LED137  200,57.5 180 top
LED138  15,66.25 180 top
LED139  25,66.25 180 top
LED140  35,66.25 180 top
LED141  45,66.25 180 top
LED142  55,66.25 180 top
LED143  65,66.25 180 top
LED144  75,66.25 180 top
LED145  85,66.25 180 top
LED146  95,66.25 180 top
LED147  105,66.25 180 top
LED148  115,66.25 180 top
LED149  125,66.25 180 top
LED150  135,66.25 180 top
LED151  145,66.25 180 top
LED152  155,66.25 180 top
LED153  165,66.25 180 top
LED154  175,66.25 180 top
LED155  185,66.25 180 top
LED156  195,66.25 180 top
LED157  10,75 180 top
LED158  20,75 180 top
LED159  30,75 180 top
LED160  40,75 180 top
LED161  50,75 180 top
LED162  60,75 180 top
LED163  70,75 180 top
LED164  80,75 180 top
LED165  90,75 180 top
LED166  100,75 180 top
LED167  110,75 180 top
LED168  120,75 180 top
LED169  130,75 180 top
LED170  140,75 180 top
LED171  150,75 180 top
LED172  160,75 180 top
LED173  170,75 180 top
LED174  180,75 180 top
LED175  190,75 180 top
LED176  200,75 180 top
LED177  15,83.75 180 top
LED178  25,83.75 180 top
LED179  35,83.75 180 top
LED180  45,83.75 180 top
LED181  55,83.75 180 top
LED182  65,83.75 180 top
LED183  75,83.75 180 top
LED184  85,83.75 180 top
LED185  95,83.75 180 top
LED186  105,83.75 180 top
LED187  115,83.75 180 top
LED188  125,83.75 180 top
LED189  135,83.75 180 top
LED190  145,83.75 180 top
LED191  155,83.75 180 top
LED192  165,83.75 180 top
LED193  175,83.75 180 top
LED194  185,83.75 180 top
LED195  195,83.75 180 top
LED196  10,92.5 180 top
LED197  20,92.5 180 top
LED198  30,92.5 180 top
LED199  40,92.5 180 top
LED200  50,92.5 180 top
LED201  60,92.5 180 top
LED202  70,92.5 180 top
LED203  80,92.5 180 top
LED204  90,92.5 180 top
LED205  100,92.5 180 top
LED206  110,92.5 180 top
LED207  120,92.5 180 top
LED208  130,92.5 180 top
LED209  140,92.5 180 top
LED210  150,92.5 180 top
LED211  160,92.5 180 top
LED212  170,92.5 180 top
LED213  180,92.5 180 top
LED214  190,92.5 180 top
LED215  200,92.5 180 top
LED216  15,101.25 180 top
LED217  25,101.25 180 top
LED218  35,101.25 180 top
LED219  45,101.25 180 top
LED220  55,101.25 180 top
LED221  65,101.25 180 top
LED222  75,101.25 180 top
LED223  85,101.25 180 top
LED224  95,101.25 180 top
LED225  105,101.25 180 top
LED226  115,101.25 180 top
LED227  125,101.25 180 top
LED228  135,101.25 180 top
LED229  145,101.25 180 top
LED230  155,101.25 180 top
LED231  165,101.25 180 top
LED232  175,101.25 180 top
LED233  185,101.25 180 top
LED234  195,101.25 180 top
LED235  10,110 180 top
LED236  20,110 180 top
LED237  30,110 180 top
LED238  40,110 180 top
LED239  50,110 180 top
LED240  60,110 180 top
LED241  70,110 180 top
LED242  80,110 180 top
LED243  90,110 180 top
LED244  100,110 180 top
LED245  110,110 180 top
LED246  120,110 180 top
LED247  130,110 180 top
LED248  140,110 180 top
LED249  150,110 180 top
LED250  160,110 180 top
LED251  170,110 180 top
LED252  180,110 180 top
LED253  190,110 180 top
LED254  200,110 180 top
LED255  15,118.75 180 top
LED256  25,118.75 180 top
LED257  35,118.75 180 top
LED258  45,118.75 180 top
LED259  55,118.75 180 top
LED260  65,118.75 180 top
LED261  75,118.75 180 top
LED262  85,118.75 180 top
LED263  95,118.75 180 top
LED264  105,118.75 180 top
LED265  115,118.75 180 top
LED266  125,118.75 180 top
LED267  135,118.75 180 top
LED268  145,118.75 180 top
LED269  155,118.75 180 top
LED270  165,118.75 180 top
LED271  175,118.75 180 top
LED272  185,118.75 180 top
LED273  195,118.75 180 top
LED274  10,127.5 180 top
LED275  20,127.5 180 top
LED276  30,127.5 180 top
LED277  40,127.5 180 top
LED278  50,127.5 180 top
LED279  60,127.5 180 top
LED280  70,127.5 180 top
LED281  80,127.5 180 top
LED282  90,127.5 180 top
LED283  100,127.5 180 top
LED284  110,127.5 180 top
LED285  120,127.5 180 top
LED286  130,127.5 180 top
LED287  140,127.5 180 top
LED288  150,127.5 180 top
LED289  160,127.5 180 top
LED290  170,127.5 180 top
LED291  180,127.5 180 top
LED292  190,127.5 180 top
LED293  200,127.5 180 top
LED294  15,136.25 180 top
LED295  25,136.25 180 top
LED296  35,136.25 180 top
LED297  45,136.25 180 top
LED298  55,136.25 180 top
LED299  65,136.25 180 top
LED300  75,136.25 180 top
LED301  85,136.25 180 top
LED302  95,136.25 180 top
LED303  105,136.25 180 top
LED304  115,136.25 180 top
LED305  125,136.25 180 top
LED306  135,136.25 180 top
LED307  145,136.25 180 top
LED308  155,136.25 180 top
LED309  165,136.25 180 top
LED310  175,136.25 180 top
LED311  185,136.25 180 top
LED312  195,136.25 180 top
LED313  10,145 180 top
LED314  20,145 180 top
LED315  30,145 180 top
LED316  40,145 180 top
LED317  50,145 180 top
LED318  60,145 180 top
LED319  70,145 180 top
LED320  80,145 180 top
LED321  90,145 180 top
LED322  100,145 180 top
LED323  110,145 180 top
LED324  120,145 180 top
LED325  130,145 180 top
LED326  140,145 180 top
LED327  150,145 180 top
LED328  160,145 180 top
LED329  170,145 180 top
LED330  180,145 180 top
LED331  190,145 180 top
LED332  200,145 180 top
VCC  204,79.38 0 top

### Tracks (layer width: path | path; a pad name or v marks a point on that pad's centre or on a via)
GND
  Bottom 1: 5,9.25 7,7.25 | 7,7.25 8.5,5.75 8.5,5 LED1.K | 9,9.25 7.25,7.5 7,7.25 | 9,9.25 13.5,13.75 LED21.K | 9,9.25 8.75,9.5 8.75,22.5 LED40.K 9,22.75 13.5,27.25 13.5,31.25 LED60.K 13.25,31.5 8.75,36 8.75,40 LED79.K 9,40.25 13.5,44.75 13.5,48.75 LED99.K 13.25,49 8.75,53.5 8.75,57.5 LED118.K 9,57.75 13.5,62.25 13.5,66.25 LED138.K 13.25,66.5 8.75,71 8.75,75 LED157.K 9,75.25 13.5,79.75 13.5,83.75 LED177.K 13.25,84 8.75,88.5 8.75,92.5 LED196.K 9,92.75 13.5,97.25 13.5,101.25 LED216.K 13.25,101.5 8.75,106 8.75,110 LED235.K 9,110.25 13.5,114.75 13.5,118.75 LED255.K 13.25,119 8.75,123.5 8.75,127.5 LED274.K 9,127.75 13.5,132.25 13.5,136.25 LED294.K 13.25,136.5 8.75,141 8.75,145 LED313.K
  pour Bottom (isolate 0.813): 0,150 210,150 210,0 0,0
N$1
  Bottom 1: LED1.A 11.5,5 18.5,5 LED2.K
N$2
  Bottom 1: LED2.A 21.5,5 28.5,5 LED3.K
N$3
  Bottom 1: LED3.A 31.5,5 38.5,5 LED4.K
N$4
  Bottom 1: LED4.A 41.5,5 48.5,5 LED5.K
N$5
  Bottom 1: LED5.A 51.5,5 58.5,5 LED6.K
N$6
  Bottom 1: LED6.A 61.5,5 68.5,5 LED7.K
N$7
  Bottom 1: LED7.A 71.5,5 78.5,5 LED8.K
N$8
  Bottom 1: LED8.A 81.5,5 88.5,5 LED9.K
N$9
  Bottom 1: LED9.A 91.5,5 98.5,5 LED10.K
N$10
  Bottom 1: LED10.A 101.5,5 108.5,5 LED11.K
N$11
  Bottom 1: LED11.A 111.5,5 118.5,5 LED12.K
N$12
  Bottom 1: LED12.A 121.5,5 128.5,5 LED13.K
N$13
  Bottom 1: LED13.A 131.5,5 138.5,5 LED14.K
N$14
  Bottom 1: LED14.A 141.5,5 148.5,5 LED15.K
N$15
  Bottom 1: LED15.A 151.5,5 158.5,5 LED16.K
N$16
  Bottom 1: LED16.A 161.5,5 168.5,5 LED17.K
N$17
  Bottom 1: LED17.A 171.5,5 178.5,5 LED18.K
N$18
  Bottom 1: LED18.A 181.5,5 188.5,5 LED19.K
N$19
  Bottom 1: LED19.A 191.5,5 198.5,5 LED20.K
N$20
  Bottom 1: D1.C 203,5 201.5,5 LED20.A
N$21
  Bottom 1: LED21.A 16.5,13.75 23.5,13.75 LED22.K
N$22
  Bottom 1: LED22.A 26.5,13.75 33.5,13.75 LED23.K
N$23
  Bottom 1: LED23.A 36.5,13.75 43.5,13.75 LED24.K
N$24
  Bottom 1: LED24.A 46.5,13.75 53.5,13.75 LED25.K
N$25
  Bottom 1: LED25.A 56.5,13.75 63.5,13.75 LED26.K
N$26
  Bottom 1: LED26.A 66.5,13.75 73.5,13.75 LED27.K
N$27
  Bottom 1: LED27.A 76.5,13.75 83.5,13.75 LED28.K
N$28
  Bottom 1: LED28.A 86.5,13.75 93.5,13.75 LED29.K
N$29
  Bottom 1: LED29.A 96.5,13.75 103.5,13.75 LED30.K
N$30
  Bottom 1: LED30.A 106.5,13.75 113.5,13.75 LED31.K
N$31
  Bottom 1: LED31.A 116.5,13.75 123.5,13.75 LED32.K
N$32
  Bottom 1: LED32.A 126.5,13.75 133.5,13.75 LED33.K
N$33
  Bottom 1: LED33.A 136.5,13.75 143.5,13.75 LED34.K
N$34
  Bottom 1: LED34.A 146.5,13.75 153.5,13.75 LED35.K
N$35
  Bottom 1: LED35.A 156.5,13.75 163.5,13.75 LED36.K
N$36
  Bottom 1: LED36.A 166.5,13.75 173.5,13.75 LED37.K
N$37
  Bottom 1: LED37.A 176.5,13.75 183.5,13.75 LED38.K
N$38
  Bottom 1: LED38.A 186.5,13.75 193.5,13.75 LED39.K
N$39
  Bottom 1: D2.C 203,13.75 196.5,13.75 LED39.A
N$40
  Bottom 1: LED40.A 11.5,22.5 18.5,22.5 LED41.K
N$41
  Bottom 1: LED41.A 21.5,22.5 28.5,22.5 LED42.K
N$42
  Bottom 1: LED42.A 31.5,22.5 38.5,22.5 LED43.K
N$43
  Bottom 1: LED43.A 41.5,22.5 48.5,22.5 LED44.K
N$44
  Bottom 1: LED44.A 51.5,22.5 58.5,22.5 LED45.K
N$45
  Bottom 1: LED45.A 61.5,22.5 68.5,22.5 LED46.K
N$46
  Bottom 1: LED46.A 71.5,22.5 78.5,22.5 LED47.K
N$47
  Bottom 1: LED47.A 81.5,22.5 88.5,22.5 LED48.K
N$48
  Bottom 1: LED48.A 91.5,22.5 98.5,22.5 LED49.K
N$49
  Bottom 1: LED49.A 101.5,22.5 108.5,22.5 LED50.K
N$50
  Bottom 1: LED50.A 111.5,22.5 118.5,22.5 LED51.K
N$51
  Bottom 1: LED51.A 121.5,22.5 128.5,22.5 LED52.K
N$52
  Bottom 1: LED52.A 131.5,22.5 138.5,22.5 LED53.K
N$53
  Bottom 1: LED53.A 141.5,22.5 148.5,22.5 LED54.K
N$54
  Bottom 1: LED54.A 151.5,22.5 158.5,22.5 LED55.K
N$55
  Bottom 1: LED55.A 161.5,22.5 168.5,22.5 LED56.K
N$56
  Bottom 1: LED56.A 171.5,22.5 178.5,22.5 LED57.K
N$57
  Bottom 1: LED57.A 181.5,22.5 188.5,22.5 LED58.K
N$58
  Bottom 1: LED58.A 191.5,22.5 198.5,22.5 LED59.K
N$59
  Bottom 1: D3.C 203,22.5 201.5,22.5 LED59.A
N$60
  Bottom 1: LED60.A 16.5,31.25 23.5,31.25 LED61.K
N$61
  Bottom 1: LED61.A 26.5,31.25 33.5,31.25 LED62.K
N$62
  Bottom 1: LED62.A 36.5,31.25 43.5,31.25 LED63.K
N$63
  Bottom 1: LED63.A 46.5,31.25 53.5,31.25 LED64.K
N$64
  Bottom 1: LED64.A 56.5,31.25 63.5,31.25 LED65.K
N$65
  Bottom 1: LED65.A 66.5,31.25 73.5,31.25 LED66.K
N$66
  Bottom 1: LED66.A 76.5,31.25 83.5,31.25 LED67.K
N$67
  Bottom 1: LED67.A 86.5,31.25 93.5,31.25 LED68.K
N$68
  Bottom 1: LED68.A 96.5,31.25 103.5,31.25 LED69.K
N$69
  Bottom 1: LED69.A 106.5,31.25 113.5,31.25 LED70.K
N$70
  Bottom 1: LED70.A 116.5,31.25 123.5,31.25 LED71.K
N$71
  Bottom 1: LED71.A 126.5,31.25 133.5,31.25 LED72.K
N$72
  Bottom 1: LED72.A 136.5,31.25 143.5,31.25 LED73.K
N$73
  Bottom 1: LED73.A 146.5,31.25 153.5,31.25 LED74.K
N$74
  Bottom 1: LED74.A 156.5,31.25 163.5,31.25 LED75.K
N$75
  Bottom 1: LED75.A 166.5,31.25 173.5,31.25 LED76.K
N$76
  Bottom 1: LED76.A 176.5,31.25 183.5,31.25 LED77.K
N$77
  Bottom 1: LED77.A 186.5,31.25 193.5,31.25 LED78.K
N$78
  Bottom 1: D4.C 203,31.25 196.5,31.25 LED78.A
N$79
  Bottom 1: LED79.A 11.5,40 18.5,40 LED80.K
N$80
  Bottom 1: LED80.A 21.5,40 28.5,40 LED81.K
N$81
  Bottom 1: LED81.A 31.5,40 38.5,40 LED82.K
N$82
  Bottom 1: LED82.A 41.5,40 48.5,40 LED83.K
N$83
  Bottom 1: LED83.A 51.5,40 58.5,40 LED84.K
N$84
  Bottom 1: LED84.A 61.5,40 68.5,40 LED85.K
N$85
  Bottom 1: LED85.A 71.5,40 78.5,40 LED86.K
N$86
  Bottom 1: LED86.A 81.5,40 88.5,40 LED87.K
N$87
  Bottom 1: LED87.A 91.5,40 98.5,40 LED88.K
N$88
  Bottom 1: LED88.A 101.5,40 108.5,40 LED89.K
N$89
  Bottom 1: LED89.A 111.5,40 118.5,40 LED90.K
N$90
  Bottom 1: LED90.A 121.5,40 128.5,40 LED91.K
N$91
  Bottom 1: LED91.A 131.5,40 138.5,40 LED92.K
N$92
  Bottom 1: LED92.A 141.5,40 148.5,40 LED93.K
N$93
  Bottom 1: LED93.A 151.5,40 158.5,40 LED94.K
N$94
  Bottom 1: LED94.A 161.5,40 168.5,40 LED95.K
N$95
  Bottom 1: LED95.A 171.5,40 178.5,40 LED96.K
N$96
  Bottom 1: LED96.A 181.5,40 188.5,40 LED97.K
N$97
  Bottom 1: LED97.A 191.5,40 198.5,40 LED98.K
N$98
  Bottom 1: D5.C 203,40 201.5,40 LED98.A
N$99
  Bottom 1: LED99.A 16.5,48.75 23.5,48.75 LED100.K
N$100
  Bottom 1: LED100.A 26.5,48.75 33.5,48.75 LED101.K
N$101
  Bottom 1: LED101.A 36.5,48.75 43.5,48.75 LED102.K
N$102
  Bottom 1: LED102.A 46.5,48.75 53.5,48.75 LED103.K
N$103
  Bottom 1: LED103.A 56.5,48.75 63.5,48.75 LED104.K
N$104
  Bottom 1: LED104.A 66.5,48.75 73.5,48.75 LED105.K
N$105
  Bottom 1: LED105.A 76.5,48.75 83.5,48.75 LED106.K
N$106
  Bottom 1: LED106.A 86.5,48.75 93.5,48.75 LED107.K
N$107
  Bottom 1: LED107.A 96.5,48.75 103.5,48.75 LED108.K
N$108
  Bottom 1: LED108.A 106.5,48.75 113.5,48.75 LED109.K
N$109
  Bottom 1: LED109.A 116.5,48.75 123.5,48.75 LED110.K
N$110
  Bottom 1: LED110.A 126.5,48.75 133.5,48.75 LED111.K
N$111
  Bottom 1: LED111.A 136.5,48.75 143.5,48.75 LED112.K
N$112
  Bottom 1: LED112.A 146.5,48.75 153.5,48.75 LED113.K
N$113
  Bottom 1: LED113.A 156.5,48.75 163.5,48.75 LED114.K
N$114
  Bottom 1: LED114.A 166.5,48.75 173.5,48.75 LED115.K
N$115
  Bottom 1: LED115.A 176.5,48.75 183.5,48.75 LED116.K
N$116
  Bottom 1: LED116.A 186.5,48.75 193.5,48.75 LED117.K
N$117
  Bottom 1: D6.C 203,48.75 196.5,48.75 LED117.A
N$118
  Bottom 1: LED118.A 11.5,57.5 18.5,57.5 LED119.K
N$119
  Bottom 1: LED119.A 21.5,57.5 28.5,57.5 LED120.K
N$120
  Bottom 1: LED120.A 31.5,57.5 38.5,57.5 LED121.K
N$121
  Bottom 1: LED121.A 41.5,57.5 48.5,57.5 LED122.K
N$122
  Bottom 1: LED122.A 51.5,57.5 58.5,57.5 LED123.K
N$123
  Bottom 1: LED123.A 61.5,57.5 68.5,57.5 LED124.K
N$124
  Bottom 1: LED124.A 71.5,57.5 78.5,57.5 LED125.K
N$125
  Bottom 1: LED125.A 81.5,57.5 88.5,57.5 LED126.K
N$126
  Bottom 1: LED126.A 91.5,57.5 98.5,57.5 LED127.K
N$127
  Bottom 1: LED127.A 101.5,57.5 108.5,57.5 LED128.K
N$128
  Bottom 1: LED128.A 111.5,57.5 118.5,57.5 LED129.K
N$129
  Bottom 1: LED129.A 121.5,57.5 128.5,57.5 LED130.K
N$130
  Bottom 1: LED130.A 131.5,57.5 138.5,57.5 LED131.K
N$131
  Bottom 1: LED131.A 141.5,57.5 148.5,57.5 LED132.K
N$132
  Bottom 1: LED132.A 151.5,57.5 158.5,57.5 LED133.K
N$133
  Bottom 1: LED133.A 161.5,57.5 168.5,57.5 LED134.K
N$134
  Bottom 1: LED134.A 171.5,57.5 178.5,57.5 LED135.K
N$135
  Bottom 1: LED135.A 181.5,57.5 188.5,57.5 LED136.K
N$136
  Bottom 1: LED136.A 191.5,57.5 198.5,57.5 LED137.K
N$137
  Bottom 1: D7.C 203,57.5 201.5,57.5 LED137.A
N$138
  Bottom 1: LED138.A 16.5,66.25 23.5,66.25 LED139.K
N$139
  Bottom 1: LED139.A 26.5,66.25 33.5,66.25 LED140.K
N$140
  Bottom 1: LED140.A 36.5,66.25 43.5,66.25 LED141.K
N$141
  Bottom 1: LED141.A 46.5,66.25 53.5,66.25 LED142.K
N$142
  Bottom 1: LED142.A 56.5,66.25 63.5,66.25 LED143.K
N$143
  Bottom 1: LED143.A 66.5,66.25 73.5,66.25 LED144.K
N$144
  Bottom 1: LED144.A 76.5,66.25 83.5,66.25 LED145.K
N$145
  Bottom 1: LED145.A 86.5,66.25 93.5,66.25 LED146.K
N$146
  Bottom 1: LED146.A 96.5,66.25 103.5,66.25 LED147.K
N$147
  Bottom 1: LED147.A 106.5,66.25 113.5,66.25 LED148.K
N$148
  Bottom 1: LED148.A 116.5,66.25 123.5,66.25 LED149.K
N$149
  Bottom 1: LED149.A 126.5,66.25 133.5,66.25 LED150.K
N$150
  Bottom 1: LED150.A 136.5,66.25 143.5,66.25 LED151.K
N$151
  Bottom 1: LED151.A 146.5,66.25 153.5,66.25 LED152.K
N$152
  Bottom 1: LED152.A 156.5,66.25 163.5,66.25 LED153.K
N$153
  Bottom 1: LED153.A 166.5,66.25 173.5,66.25 LED154.K
N$154
  Bottom 1: LED154.A 176.5,66.25 183.5,66.25 LED155.K
N$155
  Bottom 1: LED155.A 186.5,66.25 193.5,66.25 LED156.K
N$156
  Bottom 1: D8.C 203,66.25 196.5,66.25 LED156.A
N$157
  Bottom 1: LED157.A 11.5,75 18.5,75 LED158.K
N$158
  Bottom 1: LED158.A 21.5,75 28.5,75 LED159.K
N$159
  Bottom 1: LED159.A 31.5,75 38.5,75 LED160.K
N$160
  Bottom 1: LED160.A 41.5,75 48.5,75 LED161.K
N$161
  Bottom 1: LED161.A 51.5,75 58.5,75 LED162.K
N$162
  Bottom 1: LED162.A 61.5,75 68.5,75 LED163.K
N$163
  Bottom 1: LED163.A 71.5,75 78.5,75 LED164.K
N$164
  Bottom 1: LED164.A 81.5,75 88.5,75 LED165.K
N$165
  Bottom 1: LED165.A 91.5,75 98.5,75 LED166.K
N$166
  Bottom 1: LED166.A 101.5,75 108.5,75 LED167.K
N$167
  Bottom 1: LED167.A 111.5,75 118.5,75 LED168.K
N$168
  Bottom 1: LED168.A 121.5,75 128.5,75 LED169.K
N$169
  Bottom 1: LED169.A 131.5,75 138.5,75 LED170.K
N$170
  Bottom 1: LED170.A 141.5,75 148.5,75 LED171.K
N$171
  Bottom 1: LED171.A 151.5,75 158.5,75 LED172.K
N$172
  Bottom 1: LED172.A 161.5,75 168.5,75 LED173.K
N$173
  Bottom 1: LED173.A 171.5,75 178.5,75 LED174.K
N$174
  Bottom 1: LED174.A 181.5,75 188.5,75 LED175.K
N$175
  Bottom 1: LED175.A 191.5,75 198.5,75 LED176.K
N$176
  Bottom 1: D9.C 203,75 201.5,75 LED176.A
N$177
  Bottom 1: LED177.A 16.5,83.75 23.5,83.75 LED178.K
N$178
  Bottom 1: LED178.A 26.5,83.75 33.5,83.75 LED179.K
N$179
  Bottom 1: LED179.A 36.5,83.75 43.5,83.75 LED180.K
N$180
  Bottom 1: LED180.A 46.5,83.75 53.5,83.75 LED181.K
N$181
  Bottom 1: LED181.A 56.5,83.75 63.5,83.75 LED182.K
N$182
  Bottom 1: LED182.A 66.5,83.75 73.5,83.75 LED183.K
N$183
  Bottom 1: LED183.A 76.5,83.75 83.5,83.75 LED184.K
N$184
  Bottom 1: LED184.A 86.5,83.75 93.5,83.75 LED185.K
N$185
  Bottom 1: LED185.A 96.5,83.75 103.5,83.75 LED186.K
N$186
  Bottom 1: LED186.A 106.5,83.75 113.5,83.75 LED187.K
N$187
  Bottom 1: LED187.A 116.5,83.75 123.5,83.75 LED188.K
N$188
  Bottom 1: LED188.A 126.5,83.75 133.5,83.75 LED189.K
N$189
  Bottom 1: LED189.A 136.5,83.75 143.5,83.75 LED190.K
N$190
  Bottom 1: LED190.A 146.5,83.75 153.5,83.75 LED191.K
N$191
  Bottom 1: LED191.A 156.5,83.75 163.5,83.75 LED192.K
N$192
  Bottom 1: LED192.A 166.5,83.75 173.5,83.75 LED193.K
N$193
  Bottom 1: LED193.A 176.5,83.75 183.5,83.75 LED194.K
N$194
  Bottom 1: LED194.A 186.5,83.75 193.5,83.75 LED195.K
N$195
  Bottom 1: D10.C 203,83.75 196.5,83.75 LED195.A
N$196
  Bottom 1: LED196.A 11.5,92.5 18.5,92.5 LED197.K
N$197
  Bottom 1: LED197.A 21.5,92.5 28.5,92.5 LED198.K
N$198
  Bottom 1: LED198.A 31.5,92.5 38.5,92.5 LED199.K
N$199
  Bottom 1: LED199.A 41.5,92.5 48.5,92.5 LED200.K
N$200
  Bottom 1: LED200.A 51.5,92.5 58.5,92.5 LED201.K
N$201
  Bottom 1: LED201.A 61.5,92.5 68.5,92.5 LED202.K
N$202
  Bottom 1: LED202.A 71.5,92.5 78.5,92.5 LED203.K
N$203
  Bottom 1: LED203.A 81.5,92.5 88.5,92.5 LED204.K
N$204
  Bottom 1: LED204.A 91.5,92.5 98.5,92.5 LED205.K
N$205
  Bottom 1: LED205.A 101.5,92.5 108.5,92.5 LED206.K
N$206
  Bottom 1: LED206.A 111.5,92.5 118.5,92.5 LED207.K
N$207
  Bottom 1: LED207.A 121.5,92.5 128.5,92.5 LED208.K
N$208
  Bottom 1: LED208.A 131.5,92.5 138.5,92.5 LED209.K
N$209
  Bottom 1: LED209.A 141.5,92.5 148.5,92.5 LED210.K
N$210
  Bottom 1: LED210.A 151.5,92.5 158.5,92.5 LED211.K
N$211
  Bottom 1: LED211.A 161.5,92.5 168.5,92.5 LED212.K
N$212
  Bottom 1: LED212.A 171.5,92.5 178.5,92.5 LED213.K
N$213
  Bottom 1: LED213.A 181.5,92.5 188.5,92.5 LED214.K
N$214
  Bottom 1: LED214.A 191.5,92.5 198.5,92.5 LED215.K
N$215
  Bottom 1: D11.C 203,92.5 201.5,92.5 LED215.A
N$216
  Bottom 1: LED216.A 16.5,101.25 23.5,101.25 LED217.K
N$217
  Bottom 1: LED217.A 26.5,101.25 33.5,101.25 LED218.K
N$218
  Bottom 1: LED218.A 36.5,101.25 43.5,101.25 LED219.K
N$219
  Bottom 1: LED219.A 46.5,101.25 53.5,101.25 LED220.K
N$220
  Bottom 1: LED220.A 56.5,101.25 63.5,101.25 LED221.K
N$221
  Bottom 1: LED221.A 66.5,101.25 73.5,101.25 LED222.K
N$222
  Bottom 1: LED222.A 76.5,101.25 83.5,101.25 LED223.K
N$223
  Bottom 1: LED223.A 86.5,101.25 93.5,101.25 LED224.K
N$224
  Bottom 1: LED224.A 96.5,101.25 103.5,101.25 LED225.K
N$225
  Bottom 1: LED225.A 106.5,101.25 113.5,101.25 LED226.K
N$226
  Bottom 1: LED226.A 116.5,101.25 123.5,101.25 LED227.K
N$227
  Bottom 1: LED227.A 126.5,101.25 133.5,101.25 LED228.K
N$228
  Bottom 1: LED228.A 136.5,101.25 143.5,101.25 LED229.K
N$229
  Bottom 1: LED229.A 146.5,101.25 153.5,101.25 LED230.K
N$230
  Bottom 1: LED230.A 156.5,101.25 163.5,101.25 LED231.K
N$231
  Bottom 1: LED231.A 166.5,101.25 173.5,101.25 LED232.K
N$232
  Bottom 1: LED232.A 176.5,101.25 183.5,101.25 LED233.K
N$233
  Bottom 1: LED233.A 186.5,101.25 193.5,101.25 LED234.K
N$234
  Bottom 1: D12.C 203,101.25 196.5,101.25 LED234.A
N$235
  Bottom 1: LED235.A 11.5,110 18.5,110 LED236.K
N$236
  Bottom 1: LED236.A 21.5,110 28.5,110 LED237.K
N$237
  Bottom 1: LED237.A 31.5,110 38.5,110 LED238.K
N$238
  Bottom 1: LED238.A 41.5,110 48.5,110 LED239.K
N$239
  Bottom 1: LED239.A 51.5,110 58.5,110 LED240.K
N$240
  Bottom 1: LED240.A 61.5,110 68.5,110 LED241.K
N$241
  Bottom 1: LED241.A 71.5,110 78.5,110 LED242.K
N$242
  Bottom 1: LED242.A 81.5,110 88.5,110 LED243.K
N$243
  Bottom 1: LED243.A 91.5,110 98.5,110 LED244.K
N$244
  Bottom 1: LED244.A 101.5,110 108.5,110 LED245.K
N$245
  Bottom 1: LED245.A 111.5,110 118.5,110 LED246.K
N$246
  Bottom 1: LED246.A 121.5,110 128.5,110 LED247.K
N$247
  Bottom 1: LED247.A 131.5,110 138.5,110 LED248.K
N$248
  Bottom 1: LED248.A 141.5,110 148.5,110 LED249.K
N$249
  Bottom 1: LED249.A 151.5,110 158.5,110 LED250.K
N$250
  Bottom 1: LED250.A 161.5,110 168.5,110 LED251.K
N$251
  Bottom 1: LED251.A 171.5,110 178.5,110 LED252.K
N$252
  Bottom 1: LED252.A 181.5,110 188.5,110 LED253.K
N$253
  Bottom 1: LED253.A 191.5,110 198.5,110 LED254.K
N$254
  Bottom 1: D13.C 203,110 201.5,110 LED254.A
N$255
  Bottom 1: LED255.A 16.5,118.75 23.5,118.75 LED256.K
N$256
  Bottom 1: LED256.A 26.5,118.75 33.5,118.75 LED257.K
N$257
  Bottom 1: LED257.A 36.5,118.75 43.5,118.75 LED258.K
N$258
  Bottom 1: LED258.A 46.5,118.75 53.5,118.75 LED259.K
N$259
  Bottom 1: LED259.A 56.5,118.75 63.5,118.75 LED260.K
N$260
  Bottom 1: LED260.A 66.5,118.75 73.5,118.75 LED261.K
N$261
  Bottom 1: LED261.A 76.5,118.75 83.5,118.75 LED262.K
N$262
  Bottom 1: LED262.A 86.5,118.75 93.5,118.75 LED263.K
N$263
  Bottom 1: LED263.A 96.5,118.75 103.5,118.75 LED264.K
N$264
  Bottom 1: LED264.A 106.5,118.75 113.5,118.75 LED265.K
N$265
  Bottom 1: LED265.A 116.5,118.75 123.5,118.75 LED266.K
N$266
  Bottom 1: LED266.A 126.5,118.75 133.5,118.75 LED267.K
N$267
  Bottom 1: LED267.A 136.5,118.75 143.5,118.75 LED268.K
N$268
  Bottom 1: LED268.A 146.5,118.75 153.5,118.75 LED269.K
N$269
  Bottom 1: LED269.A 156.5,118.75 163.5,118.75 LED270.K
N$270
  Bottom 1: LED270.A 166.5,118.75 173.5,118.75 LED271.K
N$271
  Bottom 1: LED271.A 176.5,118.75 183.5,118.75 LED272.K
N$272
  Bottom 1: LED272.A 186.5,118.75 193.5,118.75 LED273.K
N$273
  Bottom 1: D14.C 203,118.75 196.5,118.75 LED273.A
N$274
  Bottom 1: LED274.A 11.5,127.5 18.5,127.5 LED275.K
N$275
  Bottom 1: LED275.A 21.5,127.5 28.5,127.5 LED276.K
N$276
  Bottom 1: LED276.A 31.5,127.5 38.5,127.5 LED277.K
N$277
  Bottom 1: LED277.A 41.5,127.5 48.5,127.5 LED278.K
N$278
  Bottom 1: LED278.A 51.5,127.5 58.5,127.5 LED279.K
N$279
  Bottom 1: LED279.A 61.5,127.5 68.5,127.5 LED280.K
N$280
  Bottom 1: LED280.A 71.5,127.5 78.5,127.5 LED281.K
N$281
  Bottom 1: LED281.A 81.5,127.5 88.5,127.5 LED282.K
N$282
  Bottom 1: LED282.A 91.5,127.5 98.5,127.5 LED283.K
N$283
  Bottom 1: LED283.A 101.5,127.5 108.5,127.5 LED284.K
N$284
  Bottom 1: LED284.A 111.5,127.5 118.5,127.5 LED285.K
N$285
  Bottom 1: LED285.A 121.5,127.5 128.5,127.5 LED286.K
N$286
  Bottom 1: LED286.A 131.5,127.5 138.5,127.5 LED287.K
N$287
  Bottom 1: LED287.A 141.5,127.5 148.5,127.5 LED288.K
N$288
  Bottom 1: LED288.A 151.5,127.5 158.5,127.5 LED289.K
N$289
  Bottom 1: LED289.A 161.5,127.5 168.5,127.5 LED290.K
N$290
  Bottom 1: LED290.A 171.5,127.5 178.5,127.5 LED291.K
N$291
  Bottom 1: LED291.A 181.5,127.5 188.5,127.5 LED292.K
N$292
  Bottom 1: LED292.A 191.5,127.5 198.5,127.5 LED293.K
N$293
  Bottom 1: D15.C 203,127.5 201.5,127.5 LED293.A
N$294
  Bottom 1: LED294.A 16.5,136.25 23.5,136.25 LED295.K
N$295
  Bottom 1: LED295.A 26.5,136.25 33.5,136.25 LED296.K
N$296
  Bottom 1: LED296.A 36.5,136.25 43.5,136.25 LED297.K
N$297
  Bottom 1: LED297.A 46.5,136.25 53.5,136.25 LED298.K
N$298
  Bottom 1: LED298.A 56.5,136.25 63.5,136.25 LED299.K
N$299
  Bottom 1: LED299.A 66.5,136.25 73.5,136.25 LED300.K
N$300
  Bottom 1: LED300.A 76.5,136.25 83.5,136.25 LED301.K
N$301
  Bottom 1: LED301.A 86.5,136.25 93.5,136.25 LED302.K
N$302
  Bottom 1: LED302.A 96.5,136.25 103.5,136.25 LED303.K
N$303
  Bottom 1: LED303.A 106.5,136.25 113.5,136.25 LED304.K
N$304
  Bottom 1: LED304.A 116.5,136.25 123.5,136.25 LED305.K
N$305
  Bottom 1: LED305.A 126.5,136.25 133.5,136.25 LED306.K
N$306
  Bottom 1: LED306.A 136.5,136.25 143.5,136.25 LED307.K
N$307
  Bottom 1: LED307.A 146.5,136.25 153.5,136.25 LED308.K
N$308
  Bottom 1: LED308.A 156.5,136.25 163.5,136.25 LED309.K
N$309
  Bottom 1: LED309.A 166.5,136.25 173.5,136.25 LED310.K
N$310
  Bottom 1: LED310.A 176.5,136.25 183.5,136.25 LED311.K
N$311
  Bottom 1: LED311.A 186.5,136.25 193.5,136.25 LED312.K
N$312
  Bottom 1: D16.C 203,136.25 196.5,136.25 LED312.A
N$313
  Bottom 1: LED313.A 11.5,145 18.5,145 LED314.K
N$314
  Bottom 1: LED314.A 21.5,145 28.5,145 LED315.K
N$315
  Bottom 1: LED315.A 31.5,145 38.5,145 LED316.K
N$316
  Bottom 1: LED316.A 41.5,145 48.5,145 LED317.K
N$317
  Bottom 1: LED317.A 51.5,145 58.5,145 LED318.K
N$318
  Bottom 1: LED318.A 61.5,145 68.5,145 LED319.K
N$319
  Bottom 1: LED319.A 71.5,145 78.5,145 LED320.K
N$320
  Bottom 1: LED320.A 81.5,145 88.5,145 LED321.K
N$321
  Bottom 1: LED321.A 91.5,145 98.5,145 LED322.K
N$322
  Bottom 1: LED322.A 101.5,145 108.5,145 LED323.K
N$323
  Bottom 1: LED323.A 111.5,145 118.5,145 LED324.K
N$324
  Bottom 1: LED324.A 121.5,145 128.5,145 LED325.K
N$325
  Bottom 1: LED325.A 131.5,145 138.5,145 LED326.K
N$326
  Bottom 1: LED326.A 141.5,145 148.5,145 LED327.K
N$327
  Bottom 1: LED327.A 151.5,145 158.5,145 LED328.K
N$328
  Bottom 1: LED328.A 161.5,145 168.5,145 LED329.K
N$329
  Bottom 1: LED329.A 171.5,145 178.5,145 LED330.K
N$330
  Bottom 1: LED330.A 181.5,145 188.5,145 LED331.K
N$331
  Bottom 1: LED331.A 191.5,145 198.5,145 LED332.K
N$332
  Bottom 1: D17.C 203,145 201.5,145 LED332.A
VCC
  Bottom 1: D1.A 203.75,8 206.75,7.5 206.5,7.75 206.75,8 206.75,13.75 D2.A 207,14 207,22.5 D3.A 207,22.75 207,31.25 D4.A 207,31.5 207,40 D5.A 207,40.25 207,48.75 D6.A 207,49 207,57.5 D7.A 207,57.75 207,66.25 D8.A 207,66.5 207,75 D9.A 207,75.25 207,79.38 | 207,79.38 VCC.1 | 207,79.38 207,83.75 D10.A 207,84 207,92.5 D11.A 207,92.75 207,101.25 D12.A 207,101.5 207,110 D13.A 207,110.25 207,118.75 D14.A 207,119 207,127.5 D15.A 207,127.75 207,136.25 D16.A 207,136.5 207,140 D17.A